# Altium project Emergency.PrjPcb
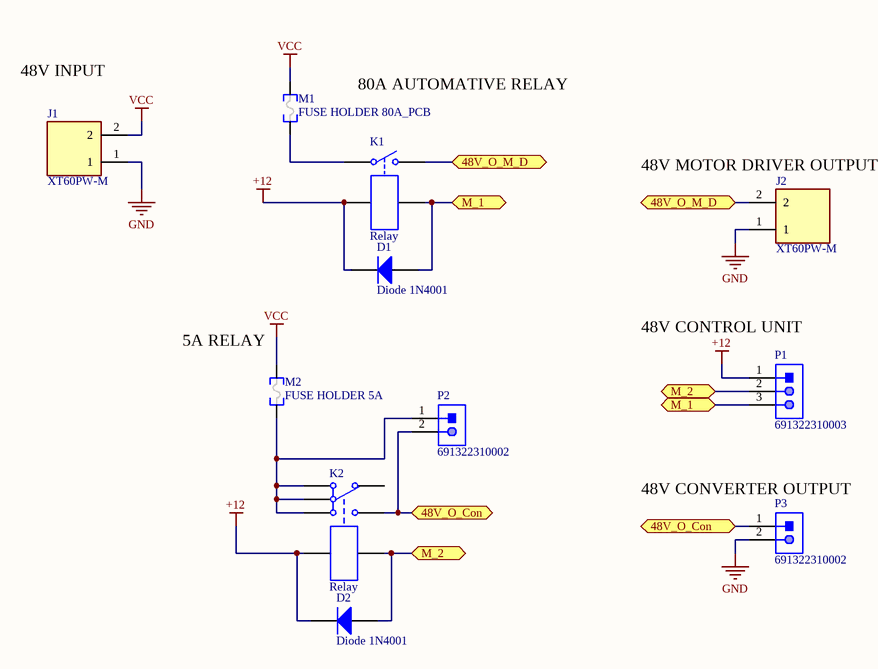
[diagram p0: Emergency.SchDoc]
1 sheet, 11 parts. Net scope: flat (ports and power ports of the same name join across sheets).
Board files: Emergency_v2.0.PcbDoc, Emergency.PcbDoc

## Sheet Emergency.SchDoc
size A4

### Parts
D1  Diode 1N4001  [DO-41]
D2  Diode 1N4001  [DO-41]
J1  XT60PW-M  [AMASS_XT60PW-M]
J2  XT60PW-M  [AMASS_XT60PW-M]
K1  Relay  [RL800 12V 80A]
K2  Relay  [TRKP 12V 40A]
M1  FUSE HOLDER 80A_PCB  [FUSE HOLDER 80A PCB]
M2  FUSE HOLDER 5A  [KEYSTONE 3568]
P1  691322310003  [691322310003]
P2  691322310002  [691322310002]
P3  691322310002  [691322310002]

### Ports
48V_O_Con (bidir), 48V_O_M_D (bidir), M_1 (bidir), M_2 (bidir)

### Nets
+12: D1.2(K) D2.2(K) K1.3 K2.6 P1.1
GND: J1.1 J2.1 P3.2
VCC: J1.2 M1.2 M2.2
NetD1_1: D1.1(A) K1.4 P1.3 ; port M_1
NetD2_1: D2.1(A) K2.7 P1.2 ; port M_2
NetJ2_2: J2.2 K1.2 ; port 48V_O_M_D
NetK1_1: K1.1 M1.1
NetK2_1: K2.1 K2.2 K2.3 M2.1 P2.1
NetK2_5: K2.5 P2.2 P3.1 ; port 48V_O_Con

Not connected (* = marked no-connect by the designer): K2 4

### Notes on the sheet
- 48V INPUT
- 80A AUTOMATIVE RELAY
- (near J2) 48V MOTOR DRIVER OUTPUT
- (near M2) 5A RELAY
- (near P1) 48V CONTROL UNIT
- (near P3) 48V CONVERTER OUTPUT

### Library data of the parts
D1 D2 = Diode 1N4001: 1 Amp General Purpose Rectifier; Published: 8-Jun-2000; LatestRevisionDate: 17-Jul-2002; LatestRevisionNote: Re-released for DXP Platform.; DatasheetVersion: 1998; PackageVersion: Aug-1999; PackageReference: DO-41; Publisher: Altium Limited; PackageDescription: Diode, Axial; Body 5.2 x 2.7 mm (LxDia. max), Lead Dia. 0.86 mm (max); Code_JEDEC: DO-204-AL; ComponentLink1Description: Manufacturer Link; ComponentLink1URL: http://www.fairchildsemi.com/; ComponentLink2Description: Datasheet; ComponentLink2URL: http://www.fairchildsemi.com/ds/1N%2F1N4001.pdf
J1 J2 = XT60PW-M: MF: AMASS; SnapEDA_Link: https://www.snapeda.com/parts/XT60PW-M%20/AMASS/view-part/3075559/?ref=snap; MP: XT60PW-M; Availability: Unavailable; Price: None; Value: *; Package: Package Analog Devices
K1 = RL800 12V 80A: Mini Röle 12V 80A Güç Rölesi 4 Fişli ÜSTÜN RL800; ComponentLink1Description: New link; ComponentLink1URL: https://urun.n11.com/role/mini-role-12v-80a-guc-rolesi-4-fisli-ustun-rl800-P368080847
K2 = TRKP 12V 40A: TRKP L-S-Z1/12VDC - RELAY 40A 12VDC FORMC; ComponentLink1Description: New link; ComponentLink1URL: https://ozdisan.com/elektromekanik-komponentler/roleler-ve-role-soketleri/genel-tip-roleler/TRKP-L-S-Z112VDC
M1 = FUSE HOLDER 80A_PCB: 80A Automative Fuse Holder PCB Baglantisi; ComponentLink1Description: New link; ComponentLink1URL: http://www.farnell.com/datasheets/1703972.pdf
M2 = FUSE HOLDER 5A: 5A Automative Fuse Holder Keystone 3568
P1 = 691322310003: WR-TBL Serie 322 Horizontal PCB Header, Pluggable, pitch 3.81mm, 3p; Compliance: RoHS; Modularity: No; Pin Number: 3; Rated Current [UL]: 10A; Working Voltage [UL]: 300VAC; ComponentLink1Description: Manufacturer; ComponentLink1URL: http://www.we-online.de; ComponentLink2URL: https://katalog.we-online.de/em/datasheet/691322310003.pdf; ComponentLink2Description: Datasheet; Mounting Technology: THT; Part Number: 691322310003; Packaging: Box; Operating Temperature: -40 to +105degC; PCB/Cable/Panel: PCB; Pitch: 3.81mm; Published Date: October 2019; Type: Horizontal; Publisher: Wurth Elektronik; Application: Pluggable
P2 P3 = 691322310002: WR-TBL Serie 322 Horizontal PCB Header, Pluggable, pitch 3.81mm, 2p; Compliance: RoHS; Modularity: No; Pin Number: 2; Rated Current [UL]: 10A; Working Voltage [UL]: 300VAC; ComponentLink1Description: Manufacturer; ComponentLink1URL: http://www.we-online.de; ComponentLink2URL: https://katalog.we-online.de/em/datasheet/691322310002.pdf; ComponentLink2Description: Datasheet; Mounting Technology: THT; Part Number: 691322310002; Packaging: Box; Operating Temperature: -40 to +105degC; PCB/Cable/Panel: PCB; Pitch: 3.81mm; Published Date: October 2019; Type: Horizontal; Publisher: Wurth Elektronik; Application: Pluggable